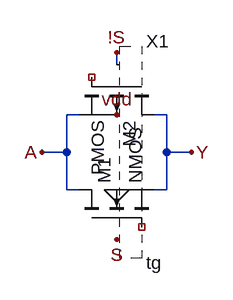
[diagram p0: schematic tg_dummy.asc]
tg_dummy.asc, the LTspice schematic file:
Version 4
SHEET 1 1292 680
WIRE -1216 -352 -1216 -368
WIRE -1264 -288 -1280 -288
WIRE -1152 -288 -1168 -288
WIRE -1280 -240 -1280 -288
WIRE -1280 -240 -1312 -240
WIRE -1152 -240 -1152 -288
WIRE -1120 -240 -1152 -240
WIRE -1280 -192 -1280 -240
WIRE -1264 -192 -1280 -192
WIRE -1152 -192 -1152 -240
WIRE -1152 -192 -1168 -192
FLAG -1216 -288 vdd
FLAG -1216 -128 S
FLAG -1216 -368 !S
FLAG -1312 -240 A
FLAG -1120 -240 Y
FLAG -1216 -192 0
SYMBOL tg -1072 -320 R0
SYMATTR InstName X1
SYMBOL nmos -1264 -144 R270
SYMATTR InstName M1
SYMBOL pmos -1168 -336 R90
SYMATTR InstName M2

The netlist it stands for:
* tg_dummy.asc
* X1: tg (symbol tg not available, pin order unknown); nets seen at it: !S, 0, S, vdd
M1 A NC_01 Y Y NMOS
M2 Y NC_02 A A PMOS
.model NMOS NMOS
.model PMOS PMOS
.lib standard.mos
.backanno
.end